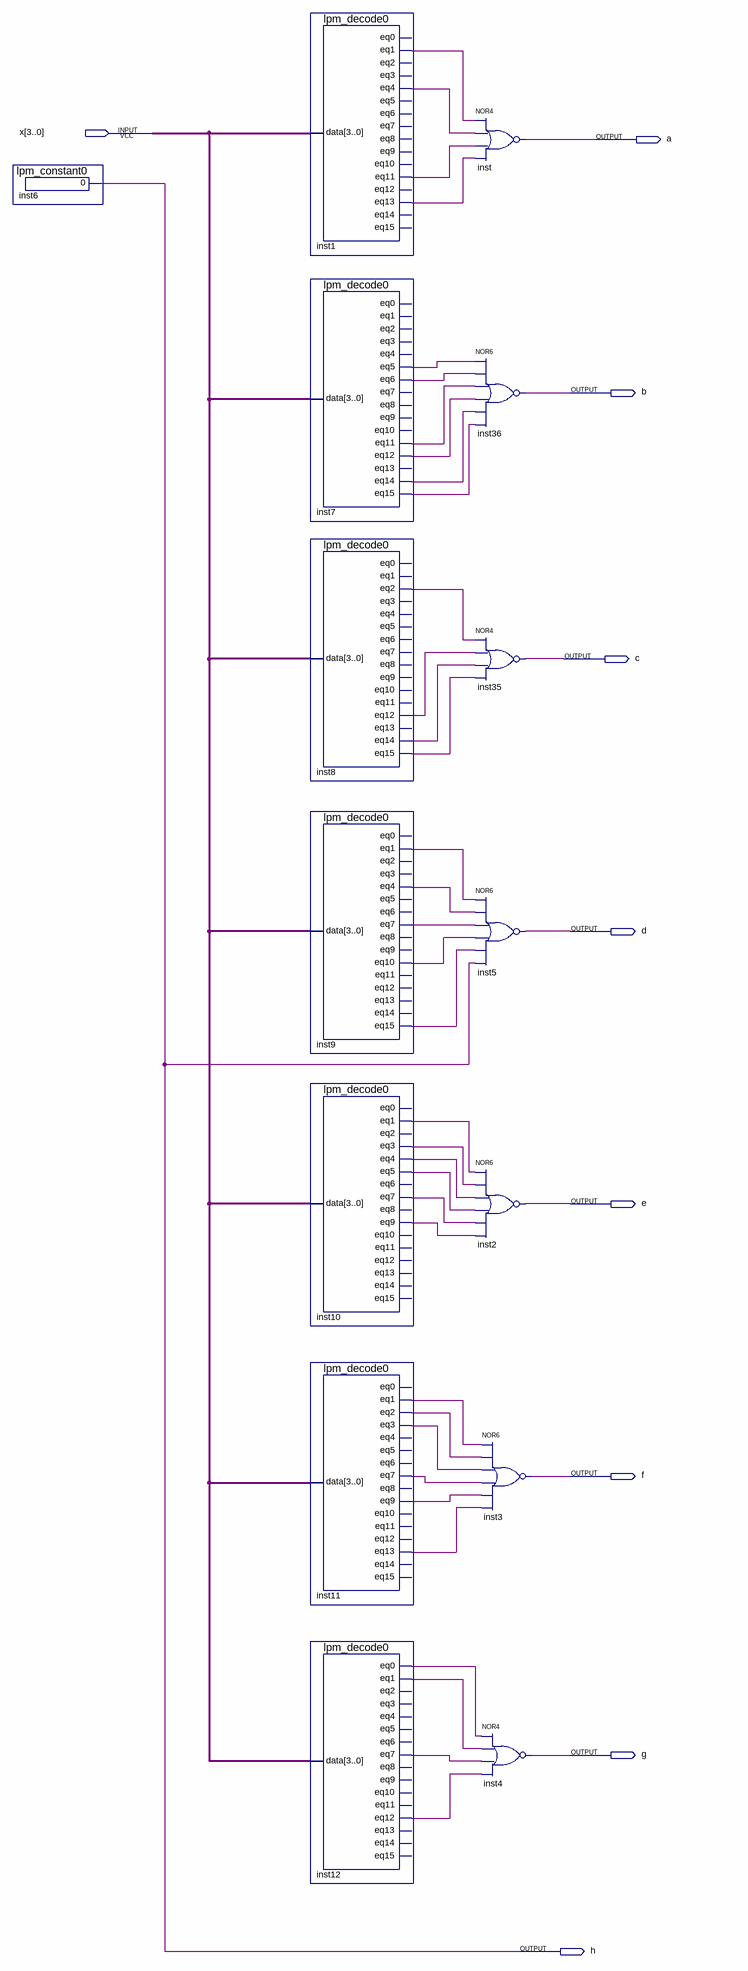
[diagram p0: schematic sheet]
// Quartus schematic lab2_2.bdf as structural Verilog: 15 symbols, 9 pins
module lab2_2 (
  input  [3:0] x,
  output a,
  output b,
  output c,
  output d,
  output e,
  output f,
  output g,
  output h
);

  wire inst1_eq1, inst1_eq4, inst1_eq11, inst1_eq13, inst7_eq5, inst7_eq6, inst7_eq11, inst7_eq12,
       inst7_eq14, inst7_eq15, inst8_eq2, inst8_eq12, inst8_eq14, inst8_eq15, inst9_eq1, inst9_eq4,
       inst9_eq7, inst9_eq10, inst9_eq15, inst10_eq1, inst10_eq3, inst10_eq4, inst10_eq5, inst10_eq7,
       inst10_eq9, inst11_eq1, inst11_eq2, inst11_eq3, inst11_eq7, inst11_eq9, inst11_eq13, inst12_eq0,
       inst12_eq1, inst12_eq7, inst12_eq12;

  lpm_constant0 inst6 (.result(h));
  lpm_decode0 inst1 (
    .data(x), .eq1(inst1_eq1), .eq4(inst1_eq4), .eq11(inst1_eq11), .eq13(inst1_eq13));  // open: eq0, eq2, eq3, eq5, eq6, eq7, eq8, eq9, eq10, eq12, eq14, eq15
  lpm_decode0 inst7 (
    .data(x), .eq5(inst7_eq5), .eq6(inst7_eq6), .eq11(inst7_eq11), .eq12(inst7_eq12), .eq14(inst7_eq14),
    .eq15(inst7_eq15));  // open: eq0, eq1, eq2, eq3, eq4, eq7, eq8, eq9, eq10, eq13
  lpm_decode0 inst8 (
    .data(x), .eq2(inst8_eq2), .eq12(inst8_eq12), .eq14(inst8_eq14), .eq15(inst8_eq15));  // open: eq0, eq1, eq3, eq4, eq5, eq6, eq7, eq8, eq9, eq10, eq11, eq13
  lpm_decode0 inst9 (
    .data(x), .eq1(inst9_eq1), .eq4(inst9_eq4), .eq7(inst9_eq7), .eq10(inst9_eq10), .eq15(inst9_eq15));  // open: eq0, eq2, eq3, eq5, eq6, eq8, eq9, eq11, eq12, eq13, eq14
  lpm_decode0 inst10 (
    .data(x), .eq1(inst10_eq1), .eq3(inst10_eq3), .eq4(inst10_eq4), .eq5(inst10_eq5), .eq7(inst10_eq7),
    .eq9(inst10_eq9));  // open: eq0, eq2, eq6, eq8, eq10, eq11, eq12, eq13, eq14, eq15
  lpm_decode0 inst11 (
    .data(x), .eq1(inst11_eq1), .eq2(inst11_eq2), .eq3(inst11_eq3), .eq7(inst11_eq7), .eq9(inst11_eq9),
    .eq13(inst11_eq13));  // open: eq0, eq4, eq5, eq6, eq8, eq10, eq11, eq12, eq14, eq15
  lpm_decode0 inst12 (
    .data(x), .eq0(inst12_eq0), .eq1(inst12_eq1), .eq7(inst12_eq7), .eq12(inst12_eq12));  // open: eq2, eq3, eq4, eq5, eq6, eq8, eq9, eq10, eq11, eq13, eq14, eq15
  nor inst (a, inst1_eq1, inst1_eq4, inst1_eq11, inst1_eq13);
  nor inst36 (b, inst7_eq5, inst7_eq6, inst7_eq11, inst7_eq12, inst7_eq14, inst7_eq15);
  nor inst35 (c, inst8_eq2, inst8_eq12, inst8_eq14, inst8_eq15);
  nor inst5 (d, inst9_eq1, inst9_eq4, inst9_eq7, inst9_eq10, inst9_eq15, h);
  nor inst2 (e, inst10_eq1, inst10_eq3, inst10_eq4, inst10_eq5, inst10_eq7, inst10_eq9);
  nor inst3 (f, inst11_eq1, inst11_eq2, inst11_eq3, inst11_eq7, inst11_eq9, inst11_eq13);
  nor inst4 (g, inst12_eq0, inst12_eq1, inst12_eq7, inst12_eq12);
endmodule
